# EasyEDA schematic easyeda file.json
TITLE: Sheet_1; REV: 1.0; Date: 2024-03-12; Sheet: 1/1; Drawn By: jurgen2107; Company: Your Company
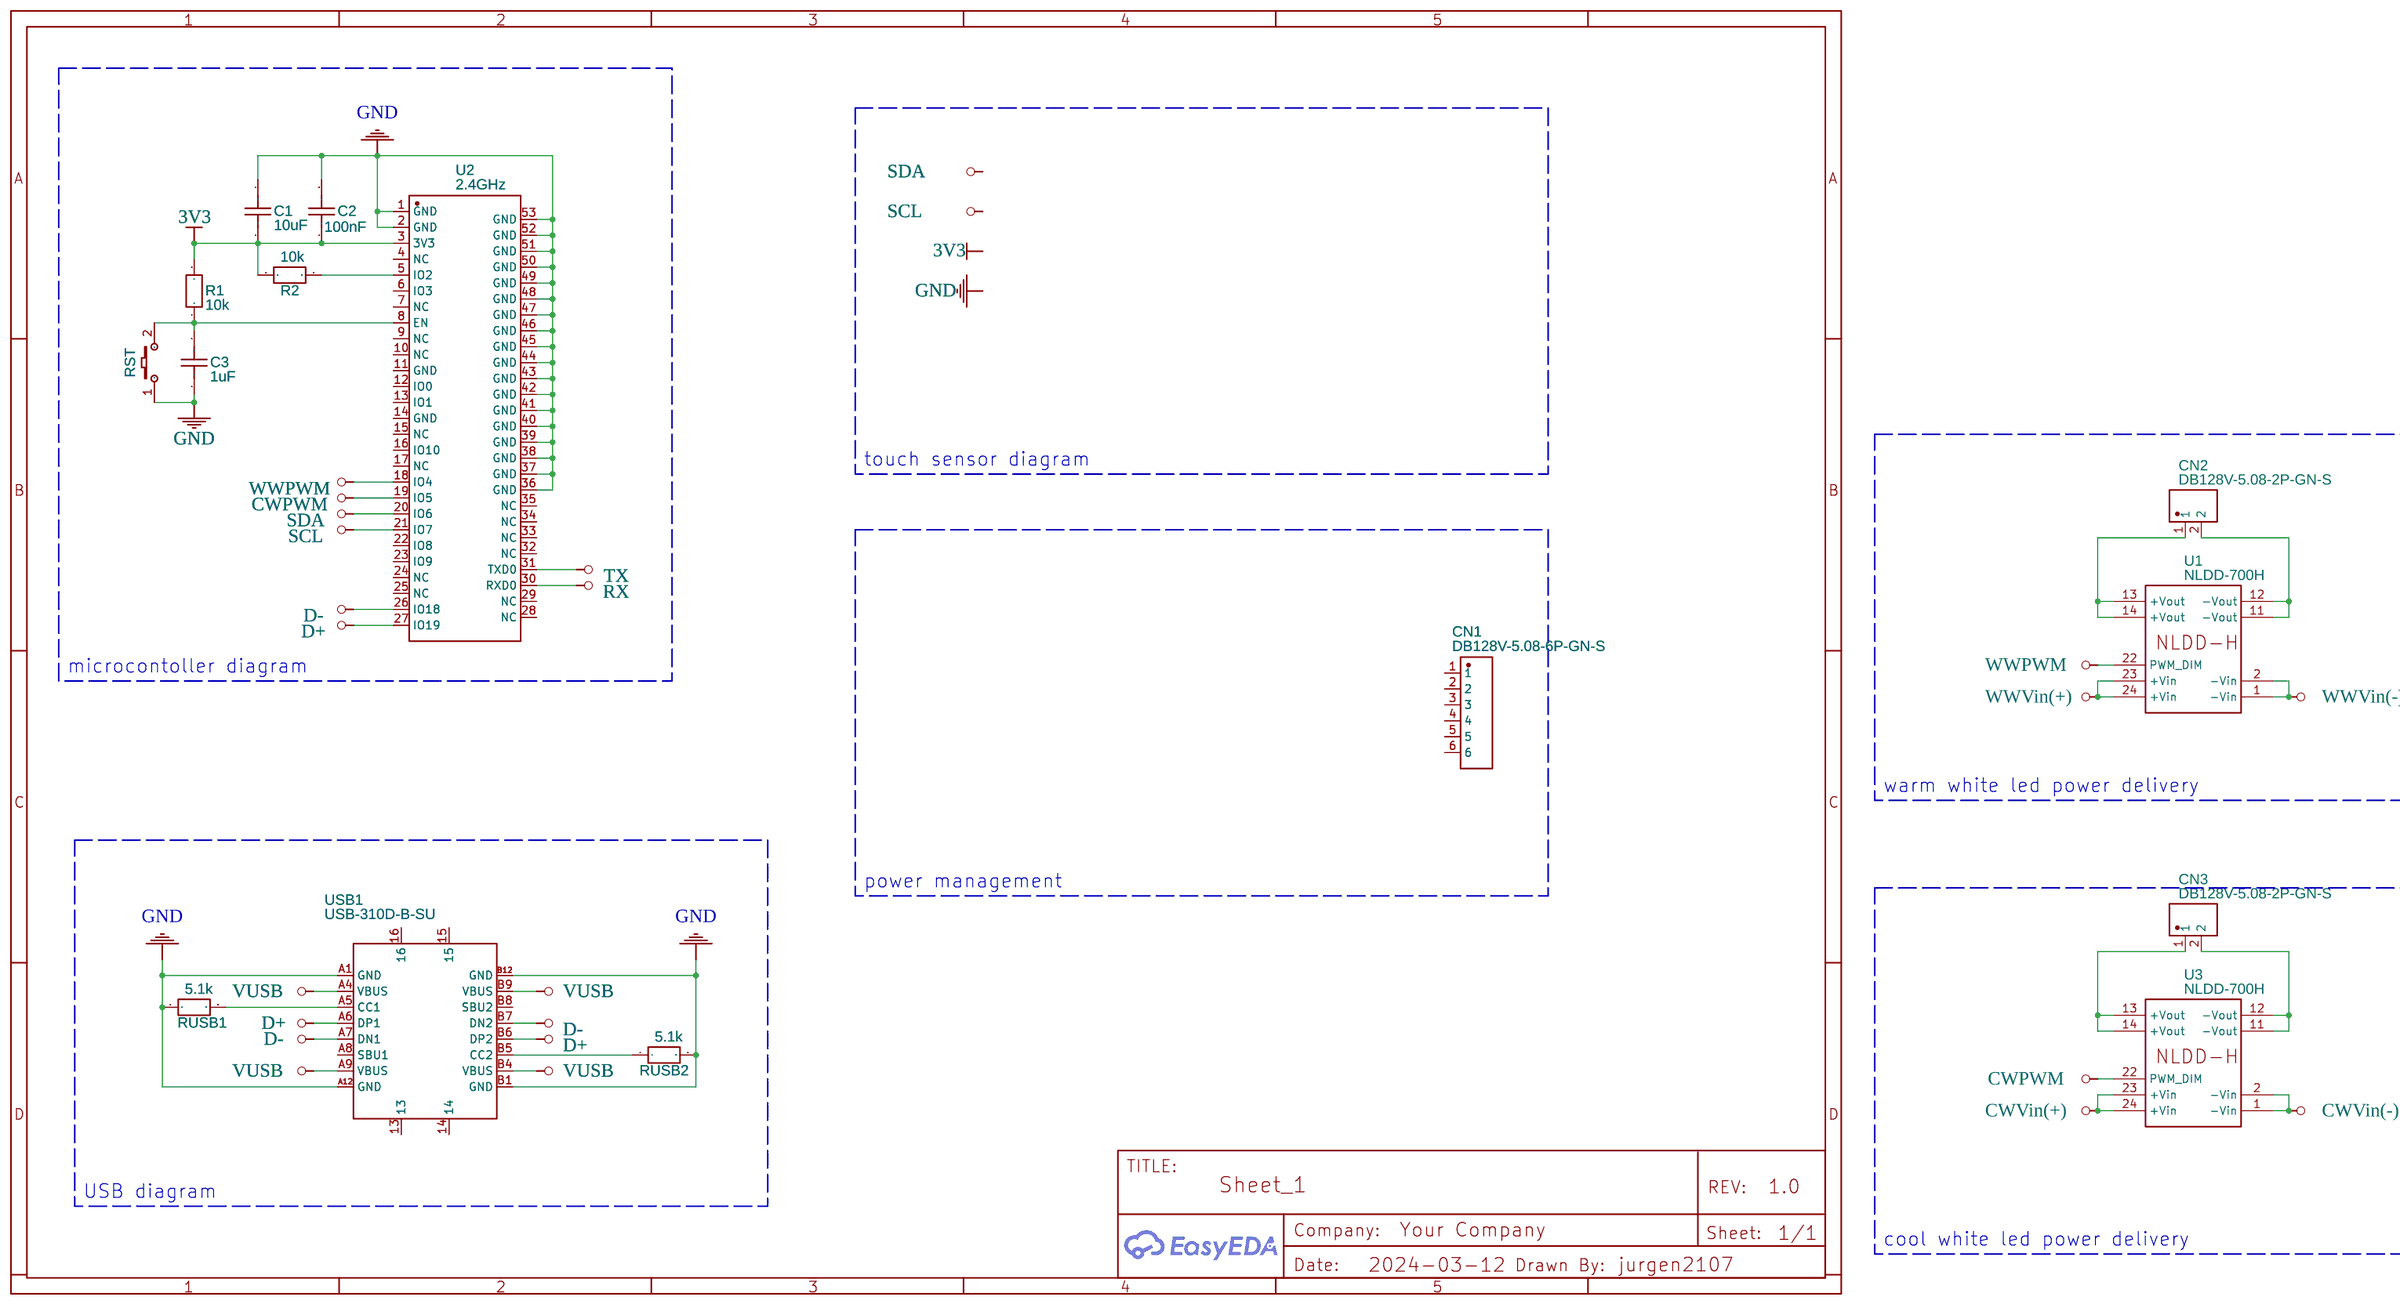
[diagram p0: schematic sheet]

## Parts
C1  10uF  [C0603]
C2  100nF  [C0603]
C3  1uF  [C0603]
CN1  DB128V-5.08-6P-GN-S  [CONN-TH_6P-P5.08_DIBO_DB128V-5.08]
CN2  DB128V-5.08-2P-GN-S  [CONN-TH_2P-P5.08_DIBO_DB128V-5.08]
CN3  DB128V-5.08-2P-GN-S  [CONN-TH_2P-P5.08_DIBO_DB128V-5.08]
R1  10k  [R0603]
R2  10k  [R0603]
RST  K2-3.6×6.1_SMD  [KEY-SMD_2P-L6.2-W3.6-LS8.0]
RUSB1  5.1k  [R0603]
RUSB2  5.1k  [R0603]
U1  NLDD-700H  [NLDD-H]
U2  2.4GHz  [WIFIM-SMD_ESP32-C3-MINI-1]
U3  NLDD-700H  [NLDD-H]
USB1  USB-310D-B-SU  [USB-C-SMD_USB-310D-B-SU]

## Library data of the parts
C1-C3 = C_0603_US: Contributor: LCEDA_Lib
CN1 = DB128V-5.08-6P-GN-S: Contributor: LCSC; Supplier: LCSC; Supplier Part: C2915642; Manufacturer: DIBO(地博电气); JLCPCB Part Class: Extended Part
CN2 CN3 = DB128V-5.08-2P-GN-S: Contributor: LCSC; Supplier: LCSC; Supplier Part: C2915639; Manufacturer: DIBO(地博电气); JLCPCB Part Class: Extended Part
R1 R2 RUSB1 RUSB2 = R_0603_EU: Contributor: LCEDA_Lib
RST = K2-3.6×6.1_SMD: Supplier Part: C118141; Supplier: LCSC; Manufacturer Part: K2-1107ST-A4SW-06; Contributor: LCEDA_Lib; 制造商: 韩国韩荣
U1 U3 = NLDD-700H: Manufacturer: MEAN WELL; Manufacturer Part: 709-NLDD-700H; Supplier: Mouser; link: https://www.mouser.de/ProductDetail/709-NLDD-700H; Contributor: robster089
U2 = ESP32-C3-MINI-1-H4(4MB): Contributor: LCSC; Supplier: LCSC; Supplier Part: C2934569; Manufacturer: ESPRESSIF(乐鑫); Manufacturer Part: ESP32-C3-MINI-1-H4; JLCPCB Part Class: Extended Part
USB1 = USB-310D-B-SU: Contributor: LCSC; Supplier: LCSC; Supplier Part: C309349; Manufacturer: HOOYA(皓宇电子); JLCPCB Part Class: Extended Part

## Nets
3V3: C1.1 C2.1 R1.2 R2.1 U2.3(3V3)
GND: C1.2 C2.2 C3.1 RST.1 RUSB1.1 RUSB2.2 U2.1(GND) U2.2(GND) U2.36(GND) U2.37(GND) U2.38(GND) U2.39(GND) U2.40(GND) U2.41(GND) U2.42(GND) U2.43(GND) U2.44(GND) U2.45(GND) U2.46(GND) U2.47(GND) U2.48(GND) U2.49(GND) U2.50(GND) U2.51(GND) U2.52(GND) U2.53(GND) USB1.A1(GND) USB1.A12(GND) USB1.B1(GND) USB1.B12(GND)
CWPWM: U2.19(IO5) U3.22(PWM DIM)
CWVin(+): U3.23(+Vin) U3.24(+Vin)
CWVin(-): U3.1(-Vin) U3.2(-Vin)
D+: U2.27(IO19) USB1.A6(DP1) USB1.B6(DP2)
D-: U2.26(IO18) USB1.A7(DN1) USB1.B7(DN2)
RX: U2.30(RXD0)
SCL: U2.21(IO7)
SDA: U2.20(IO6)
TX: U2.31(TXD0)
VUSB: USB1.A4(VBUS) USB1.A9(VBUS) USB1.B4(VBUS) USB1.B9(VBUS)
WWPWM: U1.22(PWM DIM) U2.18(IO4)
WWVin(+): U1.23(+Vin) U1.24(+Vin)
WWVin(-): U1.1(-Vin) U1.2(-Vin)
Net-(C3-2): C3.2 R1.1 RST.2 U2.8(EN)
Net-(CN2-1): CN2.1 U1.13(+Vout) U1.14(+Vout)
Net-(CN2-2): CN2.2 U1.11(-Vout) U1.12(-Vout)
Net-(CN3-1): CN3.1 U3.13(+Vout) U3.14(+Vout)
Net-(CN3-2): CN3.2 U3.11(-Vout) U3.12(-Vout)
Net-(R2-2): R2.2 U2.5(IO2)
Net-(RUSB1-2): RUSB1.2 USB1.A5(CC1)
Net-(RUSB2-1): RUSB2.1 USB1.B5(CC2)

Not connected (* = marked no-connect by the designer): CN1 1 2 3 4 5 6; U2 4(NC) 6(IO3) 7(NC) 9(NC) 10(NC) 11(GND) 12(IO0) 13(IO1) 14(GND) 15(NC) 16(IO10) 17(NC) 22(IO8) 23(IO9) 24(NC) 25(NC) 28(NC) 29(NC) 32(NC) 33(NC) 34(NC) 35(NC); USB1 13 14 15 16 A8(SBU1) B8(SBU2)

## Notes on the sheet
- touch sensor diagram
- microcontoller diagram
- warm white led power delivery
- power management
- USB diagram
- cool white led power delivery
